# EAGLE design devboard (EAGLE 9.0.1)

## Sheet 1 of 2
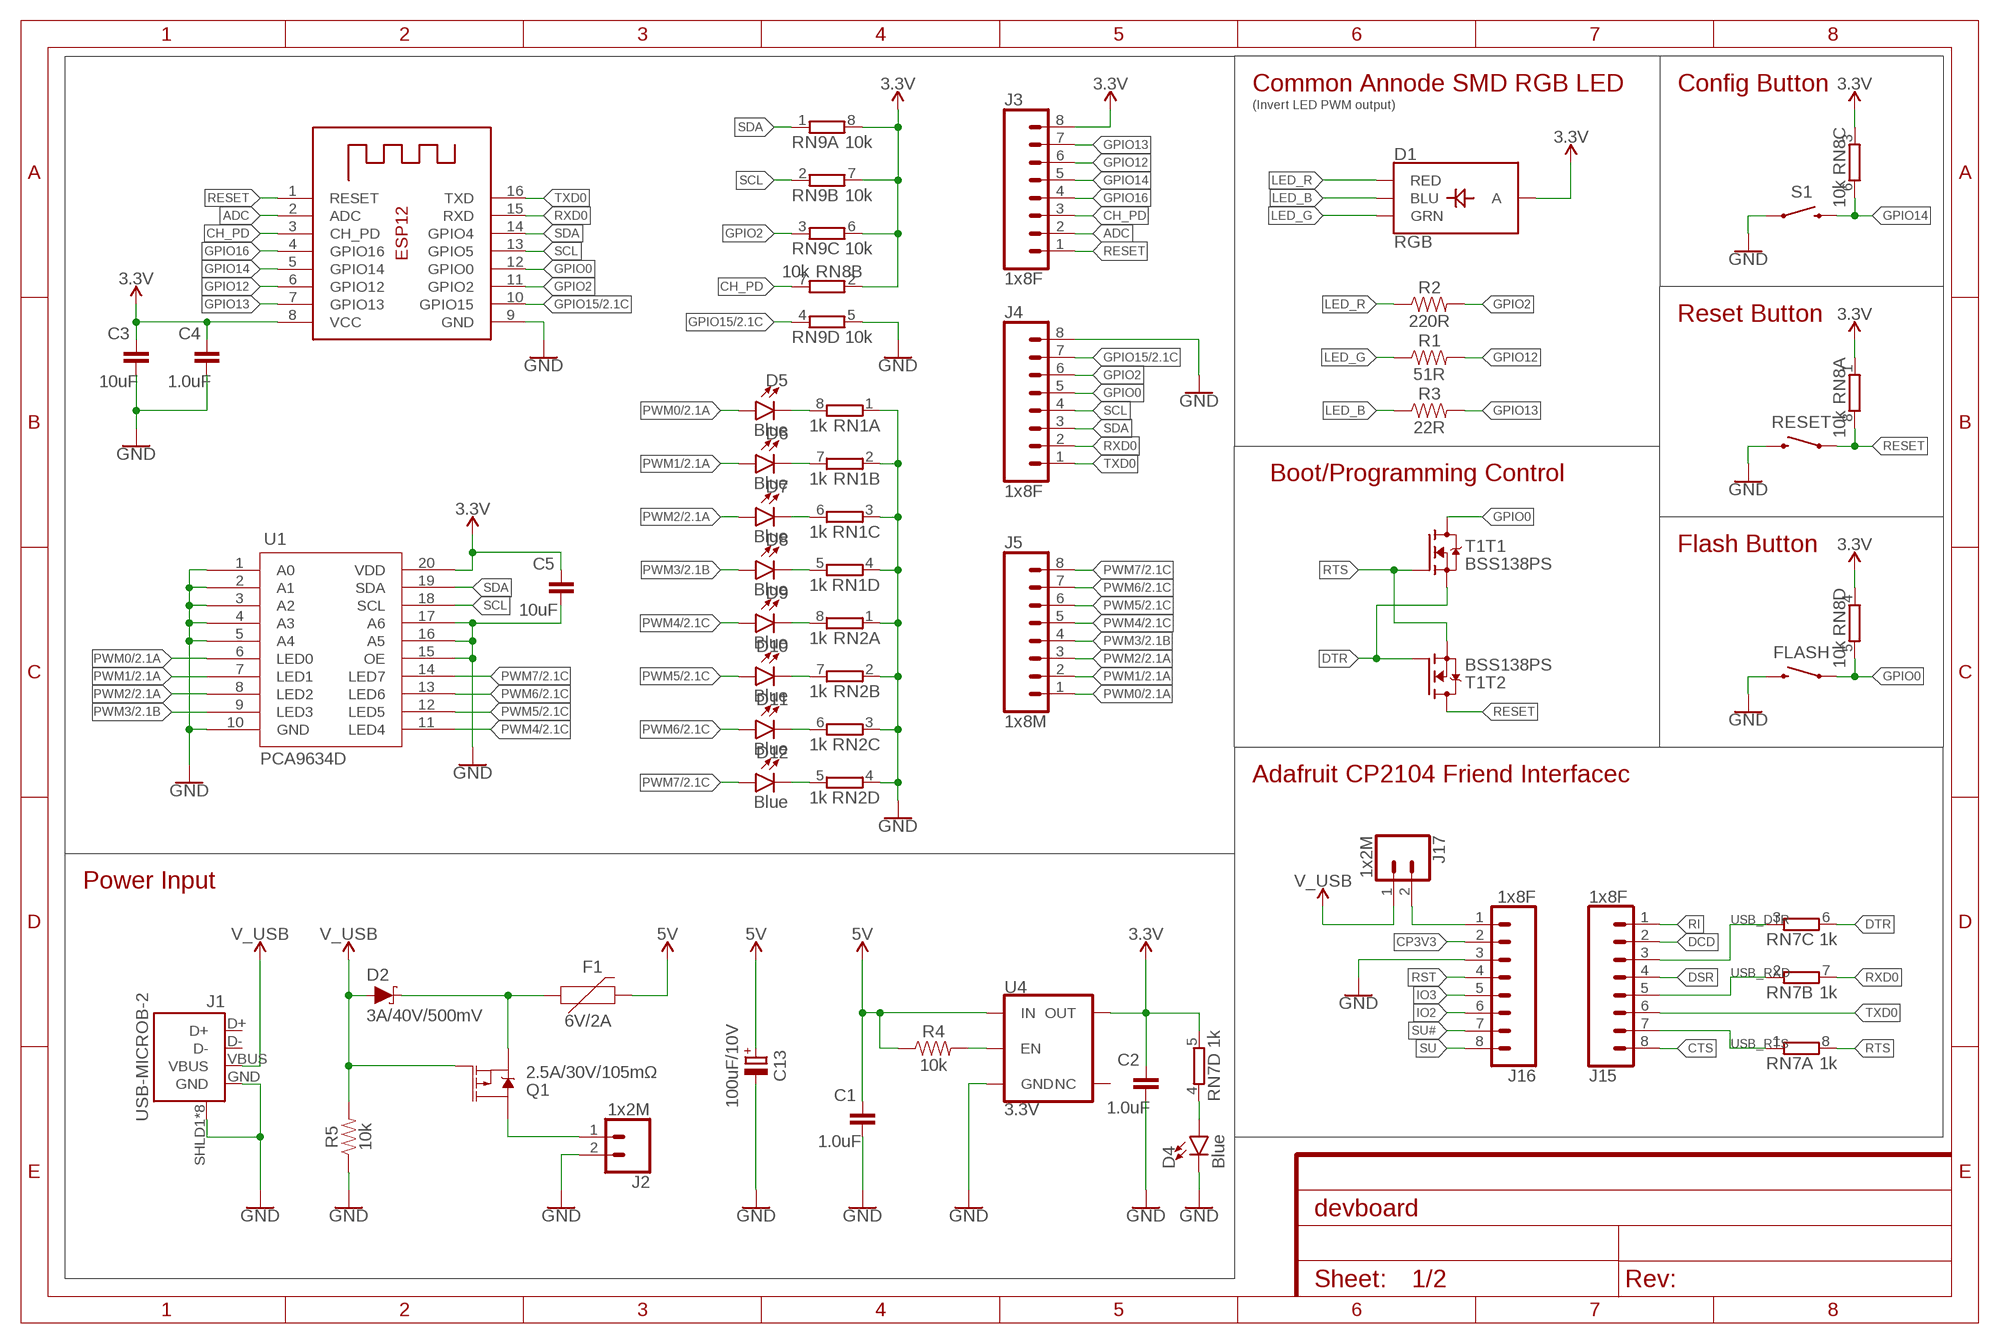
[diagram p0: schematic, sheet 1]
FRAME1 (FRAME-A4L): CNAME: VibHub ESP8266 Devboard; CREVISION: 0.1; DESIGNER: Kadah

### Parts
C1  1.0uF  CAPACITOR-1206  [C1206]
C2  1.0uF  CAPACITOR-1206  [C1206]
C3  10uF  CAPACITOR-1206  [C1206]
C4  1.0uF  CAPACITOR-1206  [C1206]
C5  10uF  CAPACITOR-1206  [C1206]
C13  100uF/10V  CAPACITOR_POLPANASONIC_D  [PANASONIC_D]
D1  RGB  LED-RGB-CAPLCC  [P-LCC-4-3]
D2  3A/40V/500mV  DIODE-SCHOTTKY-B340A  [SMA-DIODE]
D4  Blue  LED0805-NO_OUTLINE  [CHIPLED_0805_NOOUTLINE]
D5  Blue  LED0805-NO_OUTLINE  [CHIPLED_0805_NOOUTLINE]
D6  Blue  LED0805-NO_OUTLINE  [CHIPLED_0805_NOOUTLINE]
D7  Blue  LED0805-NO_OUTLINE  [CHIPLED_0805_NOOUTLINE]
D8  Blue  LED0805-NO_OUTLINE  [CHIPLED_0805_NOOUTLINE]
D9  Blue  LED0805-NO_OUTLINE  [CHIPLED_0805_NOOUTLINE]
D10  Blue  LED0805-NO_OUTLINE  [CHIPLED_0805_NOOUTLINE]
D11  Blue  LED0805-NO_OUTLINE  [CHIPLED_0805_NOOUTLINE]
D12  Blue  LED0805-NO_OUTLINE  [CHIPLED_0805_NOOUTLINE]
F1  6V/2A  PPTC_HALF-AMP  [1206]
FLASH  MOMENTARY-SWITCH-SPST-SMD-6.0X3.5MM  [TACTILE_SWITCH_SMD_6.0X3.5MM]
J1  USB-MICROB-2  [USB-MICROB-10118194]
J2  1x2M  CONN_02LOCK_LONGPADS  [1X02_LOCK_LONGPADS]
J3  1x8F  CONN_08FEMALE_LOCK  [1X08_FEMALE_LOCK]
J4  1x8F  CONN_08FEMALE_LOCK  [1X08_FEMALE_LOCK]
J5  1x8M  CONN_08LOCK  [1X08_LOCK]
J15  1x8F  CONN_08FEMALE_LOCK  [1X08_FEMALE_LOCK]
J16  1x8F  CONN_08FEMALE_LOCK  [1X08_FEMALE_LOCK]
J17  1x2M  CONN_02LOCK_LONGPADS  [1X02_LOCK_LONGPADS]
Q1  2.5A/30V/105mΩ  MOSFET_PCH-DMG2307L  [SOT23-3]
R1  51R  RESISTOR0805  [0805]
R2  220R  RESISTOR0805  [0805]
R3  22R  RESISTOR0805  [0805]
R4  10k  RESISTOR0805  [0805]
R5  10k  RESISTOR0805  [0805]
RESET  MOMENTARY-SWITCH-SPST-SMD-6.0X3.5MM  [TACTILE_SWITCH_SMD_6.0X3.5MM]
RN1  1k  4R-NEXBS8V  [EXBS8V]
RN2  1k  4R-NEXBS8V  [EXBS8V]
RN7  1k  4R-NEXBS8V  [EXBS8V]
RN8  10k  4R-NEXBS8V  [EXBS8V]
RN9  10k  4R-NEXBS8V  [EXBS8V]
S1  MOMENTARY-SWITCH-SPST-PTH-6.0MM  [TACTILE_SWITCH_PTH_6.0MM]
T1  BSS138PS  [SOT363]
U1  PCA9634D  PCA963420-SO  [SOIC127P1032X265-20]
U4  3.3V  V_REG_AP2112K-3.3V  [SOT23-5]
X1  ESP12  ESP-12  [ESP-12]

### Nets
3.3V: C2.1 C3.1 C4.1 C5.1 D1.4(A) J3.8 RN7.5 RN8.1 RN8.2 RN8.3 RN8.4 RN9.6 RN9.7 RN9.8 U1.20(VDD) U4.5(OUT) X1.8(VCC) ; also sheet 2
5V: C1.1 C13.+ F1.2 R4.1 U4.1(IN) ; also sheet 2
ADC: J3.2 X1.2(ADC)
CH_PD: J3.3 RN8.7 X1.3(CH_PD)
CP3V3: J16.2
CTS: J15.8
DCD: J15.2
DSR: J15.4
DTR: RN7.6 T1.1(T1:S) T1.5(T2:G)
GND: C1.2 C2.2 C3.2 C4.2 C5.2 C13.- D4.C FLASH.2 J1.GND J1.SHLD1(SHIELD) J1.SHLD2(SHIELD) J1.SHLD3(SHIELD) J1.SHLD4(SHIELD) J1.SHLD5(SHIELD) J1.SHLD6(SHIELD) J1.SHLD7(SHIELD) J1.SHLD8(SHIELD) J2.2 J4.8 J16.3 R5.1 RESET.2 RN1.1 RN1.2 RN1.3 RN1.4 RN2.1 RN2.2 RN2.3 RN2.4 RN9.5 S1.1 U1.1(A0) U1.2(A1) U1.3(A2) U1.4(A3) U1.5(A4) U1.10(GND) U1.15(OE) U1.16(A5) U1.17(A6) U4.2(GND) X1.9(GND) ; also sheet 2
GPIO0: FLASH.1 J4.5 RN8.5 T1.6(T1:D) X1.12(GPIO0)
GPIO2: J4.6 R2.2 RN9.3 X1.11(GPIO2)
GPIO12: J3.6 R1.2 X1.6(GPIO12)
GPIO13: J3.7 R3.2 X1.7(GPIO13)
GPIO14: J3.5 RN8.6 S1.3 X1.5(GPIO14)
GPIO15: J4.7 RN9.4 X1.10(GPIO15) ; also sheet 2
GPIO16: J3.4 X1.4(GPIO16)
IO2: J16.6
IO3: J16.5
LED_B: D1.3(BLU) R3.1
LED_G: D1.2(GRN) R1.1
LED_R: D1.1(RED) R2.1
N$1: R4.2 U4.3(EN)
N$2: D5.C RN1.8
N$3: D6.C RN1.7
N$4: J2.1 Q1.3(D)
N$5: D2.C F1.1 Q1.2(S)
N$6: D7.C RN1.6
N$7: D8.C RN1.5
N$8: D9.C RN2.8
N$9: D10.C RN2.7
N$10: D11.C RN2.6
N$11: D12.C RN2.5
N$31: J16.1 J17.2
PWM0: D5.A J5.1 U1.6(LED0) ; also sheet 2
PWM1: D6.A J5.2 U1.7(LED1) ; also sheet 2
PWM2: D7.A J5.3 U1.8(LED2) ; also sheet 2
PWM3: D8.A J5.4 U1.9(LED3) ; also sheet 2
PWM4: D9.A J5.5 U1.11(LED4) ; also sheet 2
PWM5: D10.A J5.6 U1.12(LED5) ; also sheet 2
PWM6: D11.A J5.7 U1.13(LED6) ; also sheet 2
PWM7: D12.A J5.8 U1.14(LED7) ; also sheet 2
PWR_LED: D4.A RN7.4
RESET: J3.1 RESET.1 RN8.8 T1.3(T2:D) X1.1(RESET)
RI: J15.1
RST: J16.4
RTS: RN7.8 T1.2(T1:G) T1.4(T2:S)
RXD0: J4.2 RN7.7 X1.15(RXD)
SCL: J4.4 RN9.2 U1.18(SCL) X1.13(GPIO5)
SDA: J4.3 RN9.1 U1.19(SDA) X1.14(GPIO4)
SU: J16.8
SU#: J16.7
TXD0: J4.1 J15.6 X1.16(TXD)
USB_DTR: J15.3 RN7.3
USB_RTS: J15.7 RN7.1
USB_RXD: J15.5 RN7.2
V_USB: D2.A J1.VBUS J17.1 Q1.1(G) R5.2
Unconnected: J1.D+ J1.D- U4.4(NC)

### Notes on the sheet
- Common Annode SMD RGB LED | Config Button
- (Invert LED PWM output)
- Reset Button
- Boot/Programming Control
- Flash Button
- Adafruit CP2104 Friend Interfacec
- Power Input

## Sheet 2 of 2
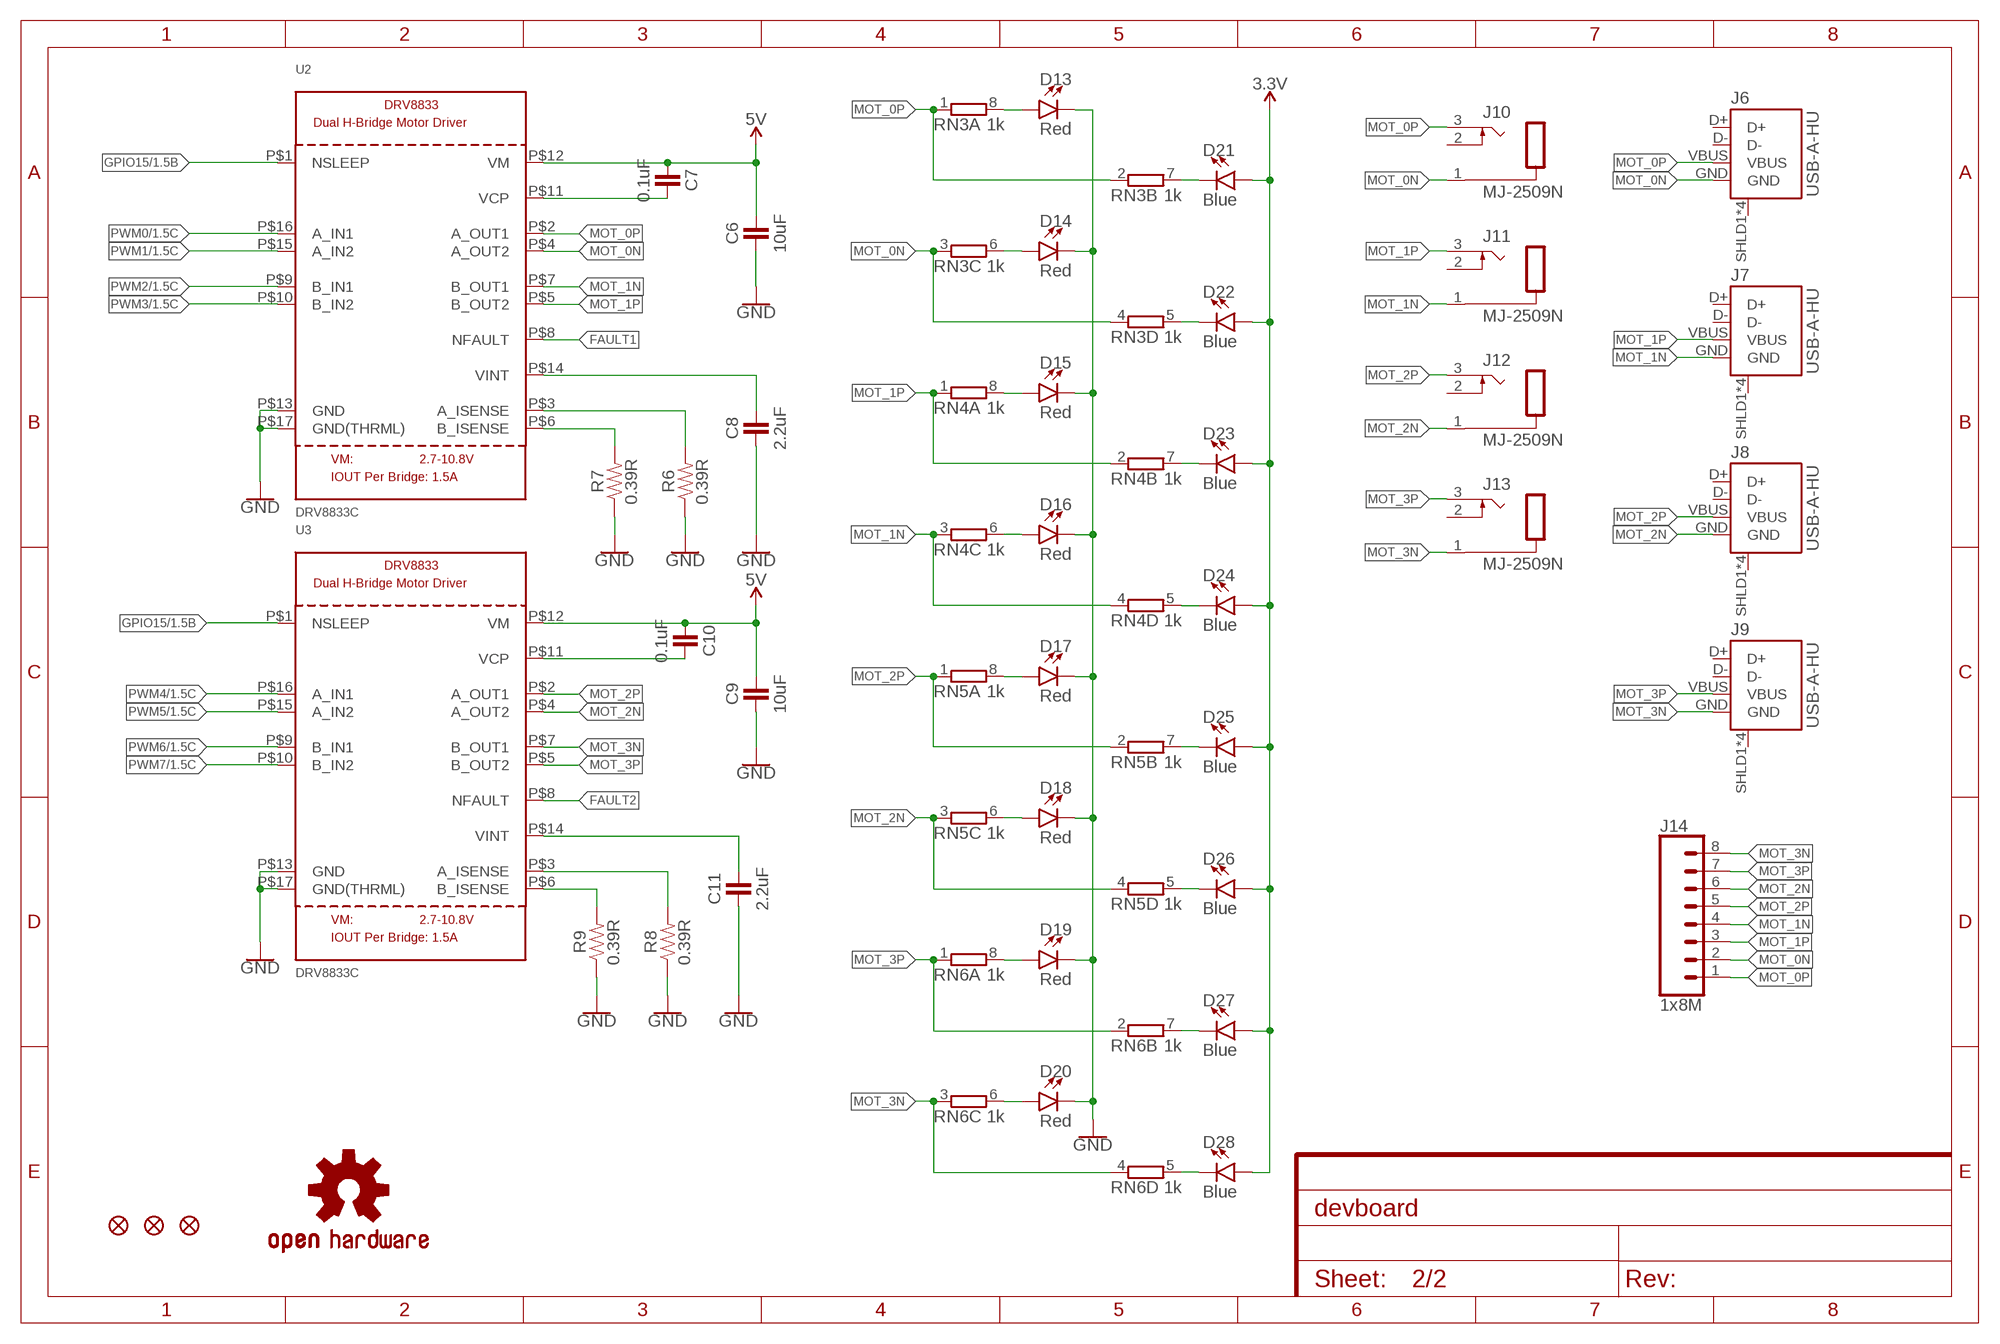
[diagram p1: schematic, sheet 2]

### Parts
C6  10uF  CAPACITOR-1206  [C1206]
C7  0.1uF  CAPACITOR-1206  [C1206]
C8  2.2uF  CAPACITOR-1206  [C1206]
C9  10uF  CAPACITOR-1206  [C1206]
C10  0.1uF  CAPACITOR-1206  [C1206]
C11  2.2uF  CAPACITOR-1206  [C1206]
D13  Red  LED0805-NO_OUTLINE  [CHIPLED_0805_NOOUTLINE]
D14  Red  LED0805-NO_OUTLINE  [CHIPLED_0805_NOOUTLINE]
D15  Red  LED0805-NO_OUTLINE  [CHIPLED_0805_NOOUTLINE]
D16  Red  LED0805-NO_OUTLINE  [CHIPLED_0805_NOOUTLINE]
D17  Red  LED0805-NO_OUTLINE  [CHIPLED_0805_NOOUTLINE]
D18  Red  LED0805-NO_OUTLINE  [CHIPLED_0805_NOOUTLINE]
D19  Red  LED0805-NO_OUTLINE  [CHIPLED_0805_NOOUTLINE]
D20  Red  LED0805-NO_OUTLINE  [CHIPLED_0805_NOOUTLINE]
D21  Blue  LED0805-NO_OUTLINE  [CHIPLED_0805_NOOUTLINE]
D22  Blue  LED0805-NO_OUTLINE  [CHIPLED_0805_NOOUTLINE]
D23  Blue  LED0805-NO_OUTLINE  [CHIPLED_0805_NOOUTLINE]
D24  Blue  LED0805-NO_OUTLINE  [CHIPLED_0805_NOOUTLINE]
D25  Blue  LED0805-NO_OUTLINE  [CHIPLED_0805_NOOUTLINE]
D26  Blue  LED0805-NO_OUTLINE  [CHIPLED_0805_NOOUTLINE]
D27  Blue  LED0805-NO_OUTLINE  [CHIPLED_0805_NOOUTLINE]
D28  Blue  LED0805-NO_OUTLINE  [CHIPLED_0805_NOOUTLINE]
FD1  FIDUCIAL1X2  [FIDUCIAL-1X2]
FD2  FIDUCIAL1X2  [FIDUCIAL-1X2]
FD3  FIDUCIAL1X2  [FIDUCIAL-1X2]
J6  USB-A-HU  [USB-A-HU]
J7  USB-A-HU  [USB-A-HU]
J8  USB-A-HU  [USB-A-HU]
J9  USB-A-HU  [USB-A-HU]
J10  MJ-2509N  [MJ-2509N]
J11  MJ-2509N  [MJ-2509N]
J12  MJ-2509N  [MJ-2509N]
J13  MJ-2509N  [MJ-2509N]
J14  1x8M  CONN_08LOCK  [1X08_LOCK]
LOGO1  OSHW-LOGOM  [OSHW-LOGO-M]
R6  0.39R  RESISTOR0805  [0805]
R7  0.39R  RESISTOR0805  [0805]
R8  0.39R  RESISTOR0805  [0805]
R9  0.39R  RESISTOR0805  [0805]
RN3  1k  4R-NEXBS8V  [EXBS8V]
RN4  1k  4R-NEXBS8V  [EXBS8V]
RN5  1k  4R-NEXBS8V  [EXBS8V]
RN6  1k  4R-NEXBS8V  [EXBS8V]
U2  DRV8833C  DRV8833  [HTSSOP16]
U3  DRV8833C  DRV8833  [HTSSOP16]

### Nets
3.3V: D21.A D22.A D23.A D24.A D25.A D26.A D27.A D28.A ; also sheet 1
5V: C6.2 C7.1 C9.2 C10.1 U2.P$12(VM) U3.P$12(VM) ; also sheet 1
A_ISENSE0: R6.2 U2.P$3(A_ISENSE)
A_ISENSE1: R8.2 U3.P$3(A_ISENSE)
B_ISENSE0: R7.2 U2.P$6(B_ISENSE)
B_ISENSE1: R9.2 U3.P$6(B_ISENSE)
FAULT1: U2.P$8(NFAULT)
FAULT2: U3.P$8(NFAULT)
GND: C6.1 C8.1 C9.1 C11.1 D13.C D14.C D15.C D16.C D17.C D18.C D19.C D20.C R6.1 R7.1 R8.1 R9.1 U2.P$13(GND) U2.P$17(GND(THRML)) U3.P$13(GND) U3.P$17(GND(THRML)) ; also sheet 1
GPIO15: U2.P$1(NSLEEP) U3.P$1(NSLEEP) ; also sheet 1
MOT_0N: J6.GND J10.1(S) J14.2 RN3.3 RN3.4 U2.P$4(A_OUT2)
MOT_0P: J6.VBUS J10.3(T) J14.1 RN3.1 RN3.2 U2.P$2(A_OUT1)
MOT_1N: J7.GND J11.1(S) J14.4 RN4.3 RN4.4 U2.P$7(B_OUT1)
MOT_1P: J7.VBUS J11.3(T) J14.3 RN4.1 RN4.2 U2.P$5(B_OUT2)
MOT_2N: J8.GND J12.1(S) J14.6 RN5.3 RN5.4 U3.P$4(A_OUT2)
MOT_2P: J8.VBUS J12.3(T) J14.5 RN5.1 RN5.2 U3.P$2(A_OUT1)
MOT_3N: J9.GND J13.1(S) J14.8 RN6.3 RN6.4 U3.P$7(B_OUT1)
MOT_3P: J9.VBUS J13.3(T) J14.7 RN6.1 RN6.2 U3.P$5(B_OUT2)
N$15: D21.C RN3.7
N$16: D13.A RN3.8
N$17: D14.A RN3.6
N$18: D15.A RN4.8
N$19: D16.A RN4.6
N$20: D17.A RN5.8
N$21: D18.A RN5.6
N$22: D19.A RN6.8
N$23: D20.A RN6.6
N$24: D22.C RN3.5
N$25: D23.C RN4.7
N$26: D24.C RN4.5
N$27: D28.C RN6.5
N$28: D27.C RN6.7
N$29: D26.C RN5.5
N$30: D25.C RN5.7
PWM0: U2.P$16(A_IN1) ; also sheet 1
PWM1: U2.P$15(A_IN2) ; also sheet 1
PWM2: U2.P$9(B_IN1) ; also sheet 1
PWM3: U2.P$10(B_IN2) ; also sheet 1
PWM4: U3.P$16(A_IN1) ; also sheet 1
PWM5: U3.P$15(A_IN2) ; also sheet 1
PWM6: U3.P$9(B_IN1) ; also sheet 1
PWM7: U3.P$10(B_IN2) ; also sheet 1
VCP0: C7.2 U2.P$11(VCP)
VCP1: C10.2 U3.P$11(VCP)
VINT0: C8.2 U2.P$14(VINT)
VINT1: C11.2 U3.P$14(VINT)
Unconnected: J6.D+ J6.D- J6.SHLD1(SHIELD) J6.SHLD2(SHIELD) J6.SHLD3(SHIELD) J6.SHLD4(SHIELD) J7.D+ J7.D- J7.SHLD1(SHIELD) J7.SHLD2(SHIELD) J7.SHLD3(SHIELD) J7.SHLD4(SHIELD) J8.D+ J8.D- J8.SHLD1(SHIELD) J8.SHLD2(SHIELD) J8.SHLD3(SHIELD) J8.SHLD4(SHIELD) J9.D+ J9.D- J9.SHLD1(SHIELD) J9.SHLD2(SHIELD) J9.SHLD3(SHIELD) J9.SHLD4(SHIELD) J10.2(TS) J11.2(TS) J12.2(TS) J13.2(TS)

## Library data of the parts
C1-C11 = vibhud:CAPACITOR: Capacitors ...2.2uF @ 6.3V -> 0402 ...4.7uF @ 6.3V -> 0603 ...10uF @ 16V -> 0805 ...22uF @ 25V -> 1206
C13 = vibhud:CAPACITOR_POL: Polarized Capacitors
D1 = vibhud:LED-RGB-CA: LED-RGB Diffused Common Anode Packages: LED RGB-THRU P-LCC-4-3 LED-TRICOLOR-SMD SparkFun Products: RGB Diffused Common Anode- Diffuse <[https://www.sparkfun.com/products/10821]> RGB Diffused Common Anode - Clear <[https://www.sparkfun.com/products/10820]> Qduino Mini <[https://www.sparkfun.com/products/13614]> Triple Output LED RGB - SMD <https://www.sparkfun.com/products/7844>; PROD_ID: DIO-12986
D2 = vibhud:DIODE-SCHOTTKY: Schottky diode A Schottky diode is a semiconductor diode which has a low forward voltage drop and a very fast switching action.; PROD_ID: DIO-09886
D4-D28 = vibhud:LED: LED (Generic) Standard schematic elements and footprints for 5mm, 3mm, 1206, and 0603 sized LEDs. Generic LEDs with no color specified.
F1 = vibhud:PPTC: Resettable Fuse PPTC Resettable Fuse. Really a sort of resistor with a polymeric positive temperature coefficient whose resistance increases dramatically with an increase in temperature. When heated by the power passing through the resistance rises causing the current to be limited, protecting the circuit. This is achieved by the transition of the polymer from a crystalline to an amorphous state where the conductive carbon separates breaking the conductive pathways found in the cool crystalline structure. When a PPTC cools back down it resumes conducting letting the circuit turn back on. SparkFun Products: SparkFun RedBoard - Programmed with Arduino <https://www.sparkfun.com/products/12757> Pro Micro - 5V/16MHz <https://www.sparkfun.com/products/12640> Arduino Pro 328 - 5V/16MHz <https://www.sparkfun.com/products/10915> MP3 Trigger <https://www.sparkfun.com/products/13720>; PROD_ID: RES-08585; VALUE: 6V/0.5A
FD1-FD3 = vibhud:FIDUCIAL: Fiducial Alignment Points Point-of-reference for pick-and-place machines and other optical instruments.
FLASH RESET = vibhud:MOMENTARY-SWITCH-SPST: Momentary Switch (Pushbutton) - SPST Normally-open (NO) SPST momentary switches (buttons, pushbuttons). Variants PTH-12MM - 12mm square, through-hole Momentary Pushbutton Switch - 12mm Square <https://www.sparkfun.com/products/9190> (COM-09190) PTH-6.0MM, PTH-6.0MM-KIT - 6.0mm square, through-hole Mini Pushbutton Switch <https://www.sparkfun.com/products/97> (COM-00097) KIT package intended for soldering kit's - only one side of pads' copper is exposed. PTH-RIGHT-ANGLE-KIT - Right-angle, through-hole Right Angle Tactile Button <https://www.sparkfun.com/products/10791> - Used on SparkFun BigTime Watch Kit <https://www.sparkfun.com/products/11734> SMD-12MM - 12mm square, surface-mount Tactile Button - SMD (12mm) <https://www.sparkfun.com/products/12993> (COM-12993) Used on SparkFun PicoBoard <https://www.sparkfun.com/products/11888> SMD-4.5MM - 4.5mm Square Trackball Switch Used on SparkFun Blackberry Trackballer Breakout <https://www.sparkfun.com/products/13169> SMD-4.6MMX2.8MM - 4.60mm x 2.80mm, surface mount Used on SparkFun SAMD21 Mini Breakout <https://www.sparkfun.com/products/13664> SMD-5.2MM, SMD-5.2-REDUNDANT - 5.2mm square, surface-mount Mini Pushbutton Switch - SMD <https://www.sparkfun.com/products/8720> (COM-08720) Used on Arduino Pro Mini <https://www.sparkfun.com/products/11114> REDUNDANT package connects both switch circuits together SMD-6.0X3.5MM - 6.0 x 3.5mm, surface mount Momentary Reset Switch SMD <https://www.sparkfun.com/products/8229> (COM-08229) SMD-6.2MM-TALL - 6.2mm square, surface mount Tactile Button - SMD (6mm) <https://www.sparkfun.com/products/12992> Used on SparkFun Digital Sandbox <https://www.sparkfun.com/products/12651> SMD-RIGHT-ANGLE - Right-angle, surface mount Used on SparkFun Block for Intel® Edison - Arduino <https://www.sparkfun.com/products/13036>; PROD_ID: SWCH-00815; SF_SKU: COM-08229
J1 = vibhud:USB: USB Connectors; DIGIKEY: 609-4618-6-ND
J2 J17 = vibhud:CONN_02: Multi connection point. Often used as Generic Header-pin footprint for 0.1 inch spaced/style header connections On any of the 0.1 inch spaced packages, you can populate with these: Break Away Headers - Straight <https://www.sparkfun.com/products/116> (PRT-00116) Break Away Male Headers - Right Angle <https://www.sparkfun.com/products/553> (PRT-00553) Female Headers <https://www.sparkfun.com/products/115> (PRT-00115) Break Away Headers - Machine Pin <https://www.sparkfun.com/products/117> (PRT-00117) Break Away Female Headers - Swiss Machine Pin <https://www.sparkfun.com/products/743> (PRT-00743) For SCREWTERMINALS and SPRING TERMINALS visit here: Screw Terimnals on SparkFun.com <https://www.sparkfun.com/search/results?term=Screw+Terminals> (5mm/3.5mm/2.54mm spacing) This device is also useful as a general connection point to wire up your design to another part of your project. Our various solder wires solder well into these plated through hole pads. Hook-Up Wire - Assortment (Stranded, 22 AWG) <https://www.sparkfun.com/products/11375> (PRT-11375) Hook-Up Wire - Assortment (Solid Core, 22 AWG) <https://www.sparkfun.com/products/11367> (PRT-11367) View the entire wire category on our website here <https://www.sparkfun.com/categories/141> Special notes: Molex polarized connector foot print use with: PRT-08233 with associated crimp pins and housings. 2.54_SCREWTERM for use with PRT-10571. 3.5mm Screw Terminal footprints for PRT-08084 5mm Screw Terminal footprints for use with PRT-08432
J3 J4 J15 J16 = vibhud:CONN_08: Multi connection point. Often used as Generic Header-pin footprint for 0.1 inch spaced/style header connections On any of the 0.1 inch spaced packages, you can populate with these: Break Away Headers - Straight <https://www.sparkfun.com/products/116> (PRT-00116) Break Away Male Headers - Right Angle <https://www.sparkfun.com/products/553> (PRT-00553) Female Headers <https://www.sparkfun.com/products/115> (PRT-00115) Break Away Headers - Machine Pin <https://www.sparkfun.com/products/117> (PRT-00117) Break Away Female Headers - Swiss Machine Pin <https://www.sparkfun.com/products/743> (PRT-00743) Arduino Stackable Header - 8 Pin <https://www.sparkfun.com/products/9279> (PRT-09279) For SCREWTERMINALS and SPRING TERMINALS visit here: Screw Terimnals on SparkFun.com <https://www.sparkfun.com/search/results?term=Screw+Terminals> (5mm/3.5mm/2.54mm spacing) This device is also useful as a general connection point to wire up your design to another part of your project. Our various solder wires solder well into these plated through hole pads. Hook-Up Wire - Assortment (Stranded, 22 AWG) <https://www.sparkfun.com/products/11375> (PRT-11375) Hook-Up Wire - Assortment (Solid Core, 22 AWG) <https://www.sparkfun.com/products/11367> (PRT-11367) View the entire wire category on our website here <https://www.sparkfun.com/categories/141> Special notes: Molex polarized connector foot print use with SKU : PRT-08231 with associated crimp pins and housings. 1MM SMD Version SKU: PRT-10208 NOTES ON THE VARIANTS LOCK and LOCK_LONGPADS... This footprint was designed to help hold the alignment of a through-hole component (i.e. 6-pin header) while soldering it into place. You may notice that each hole has been shifted either up or down by 0.005 of an inch from it's more standard position (which is a perfectly straight line). This slight alteration caused the pins (the squares in the middle) to touch the edges of the holes. Because they are alternating, it causes a "brace" to hold the component in place. 0.005 has proven to be the perfect amount of "off-center" position when using our standard breakaway headers. Although looks a little odd when you look at the bare footprint, once you have a header in there, the alteration is very hard to notice. Also,if you push a header all the way into place, it is covered up entirely on the bottom side.; PROD_ID: CONN-09233; SF_ID: PRT-09279
J5 J14 = vibhud:CONN_08: Multi connection point. Often used as Generic Header-pin footprint for 0.1 inch spaced/style header connections On any of the 0.1 inch spaced packages, you can populate with these: Break Away Headers - Straight <https://www.sparkfun.com/products/116> (PRT-00116) Break Away Male Headers - Right Angle <https://www.sparkfun.com/products/553> (PRT-00553) Female Headers <https://www.sparkfun.com/products/115> (PRT-00115) Break Away Headers - Machine Pin <https://www.sparkfun.com/products/117> (PRT-00117) Break Away Female Headers - Swiss Machine Pin <https://www.sparkfun.com/products/743> (PRT-00743) Arduino Stackable Header - 8 Pin <https://www.sparkfun.com/products/9279> (PRT-09279) For SCREWTERMINALS and SPRING TERMINALS visit here: Screw Terimnals on SparkFun.com <https://www.sparkfun.com/search/results?term=Screw+Terminals> (5mm/3.5mm/2.54mm spacing) This device is also useful as a general connection point to wire up your design to another part of your project. Our various solder wires solder well into these plated through hole pads. Hook-Up Wire - Assortment (Stranded, 22 AWG) <https://www.sparkfun.com/products/11375> (PRT-11375) Hook-Up Wire - Assortment (Solid Core, 22 AWG) <https://www.sparkfun.com/products/11367> (PRT-11367) View the entire wire category on our website here <https://www.sparkfun.com/categories/141> Special notes: Molex polarized connector foot print use with SKU : PRT-08231 with associated crimp pins and housings. 1MM SMD Version SKU: PRT-10208 NOTES ON THE VARIANTS LOCK and LOCK_LONGPADS... This footprint was designed to help hold the alignment of a through-hole component (i.e. 6-pin header) while soldering it into place. You may notice that each hole has been shifted either up or down by 0.005 of an inch from it's more standard position (which is a perfectly straight line). This slight alteration caused the pins (the squares in the middle) to touch the edges of the holes. Because they are alternating, it causes a "brace" to hold the component in place. 0.005 has proven to be the perfect amount of "off-center" position when using our standard breakaway headers. Although looks a little odd when you look at the bare footprint, once you have a header in there, the alteration is very hard to notice. Also,if you push a header all the way into place, it is covered up entirely on the bottom side.
J6-J9 = vibhud:USB: USB Connectors
J10-J13 = vibhud:MJ-2509N: Mono Audio Jack, 2.5 MM
LOGO1 = vibhud:OSHW-LOGO: Open-Source Hardware (OSHW) Logo This logo indicates the piece of hardware it is found on incorporates a OSHW license and/or adheres to the definition of open source hardware found here: http://freedomdefined.org/OSHW
Q1 = vibhud:MOSFET_PCH: P-channel MOSFETs Voltage controlled devices that allow control of high current outputs. SparkFun Products: SparkFun ESP32 Thing <https://www.sparkfun.com/products/13907> SparkFun ESP8266 Thing <https://www.sparkfun.com/products/13231>; PROD_ID: TRANS-11308
R1-R9 = vibhud:RESISTOR: Generic Resistor Package
RN1-RN9 = vibhud:4R-N: Array Chip Resistor Source: RS Component / Phycomp; OC_FARNELL: unknown; OC_NEWARK: unknown
S1 = vibhud:MOMENTARY-SWITCH-SPST: Momentary Switch (Pushbutton) - SPST Normally-open (NO) SPST momentary switches (buttons, pushbuttons). Variants PTH-12MM - 12mm square, through-hole Momentary Pushbutton Switch - 12mm Square <https://www.sparkfun.com/products/9190> (COM-09190) PTH-6.0MM, PTH-6.0MM-KIT - 6.0mm square, through-hole Mini Pushbutton Switch <https://www.sparkfun.com/products/97> (COM-00097) KIT package intended for soldering kit's - only one side of pads' copper is exposed. PTH-RIGHT-ANGLE-KIT - Right-angle, through-hole Right Angle Tactile Button <https://www.sparkfun.com/products/10791> - Used on SparkFun BigTime Watch Kit <https://www.sparkfun.com/products/11734> SMD-12MM - 12mm square, surface-mount Tactile Button - SMD (12mm) <https://www.sparkfun.com/products/12993> (COM-12993) Used on SparkFun PicoBoard <https://www.sparkfun.com/products/11888> SMD-4.5MM - 4.5mm Square Trackball Switch Used on SparkFun Blackberry Trackballer Breakout <https://www.sparkfun.com/products/13169> SMD-4.6MMX2.8MM - 4.60mm x 2.80mm, surface mount Used on SparkFun SAMD21 Mini Breakout <https://www.sparkfun.com/products/13664> SMD-5.2MM, SMD-5.2-REDUNDANT - 5.2mm square, surface-mount Mini Pushbutton Switch - SMD <https://www.sparkfun.com/products/8720> (COM-08720) Used on Arduino Pro Mini <https://www.sparkfun.com/products/11114> REDUNDANT package connects both switch circuits together SMD-6.0X3.5MM - 6.0 x 3.5mm, surface mount Momentary Reset Switch SMD <https://www.sparkfun.com/products/8229> (COM-08229) SMD-6.2MM-TALL - 6.2mm square, surface mount Tactile Button - SMD (6mm) <https://www.sparkfun.com/products/12992> Used on SparkFun Digital Sandbox <https://www.sparkfun.com/products/12651> SMD-RIGHT-ANGLE - Right-angle, surface mount Used on SparkFun Block for Intel® Edison - Arduino <https://www.sparkfun.com/products/13036>; PROD_ID: SWCH-08441; SF_SKU: COM-00097
T1 = vibhud:BSS138PS: Dual N-Channel MOSFET BSS138 (Vgs>=+/-20V, Vds>=40V, Id>=0.2A + Rds<=3Ohm @ Vgs=4.5V)
U1 = vibhud:PCA9634
U2 U3 = vibhud:DRV8833: DRV8833 Dual H-Bridge Motor Driver -- HTSSOP Package
U4 = vibhud:V_REG_AP2112: AP2112 - 600mA CMOS LDO Regulator w/ Enable The AP2112 is CMOS process low dropout linear regulator with enable function, the regulator delivers a guaranteed 600mA (min.) continuous load current. Features Output Voltage Accuracy: ±1.5% Output Current: 600mA (Min.) Foldback Short Current Protection: 50mA Enable Function to Turn ON/OFF VOUT Low Dropout Voltage (3.3V): 250mV (Typ.) @IOUT=600mA Excellent Load Regulation: 0.2%/A (Typ.) Excellent Line Regulation: 0.02%/V (Typ.) Low Quiescent Current: 55μA (Typ.) Low Standby Current: 0.01μA (Typ.) Low Output Noise: 50μVRMS PSRR: 100Hz -65dB, 1kHz -65dB OTSD Protection Stable with 1.0μF Flexible Cap: Ceramic, Tantalum and Aluminum Electrolytic Operation Temperature Range: -40°C to 85°C ESD: MM 400V, HBM 4000V; PROD_ID: VREG-12457
X1 = vibhud:ESP-12

## Board
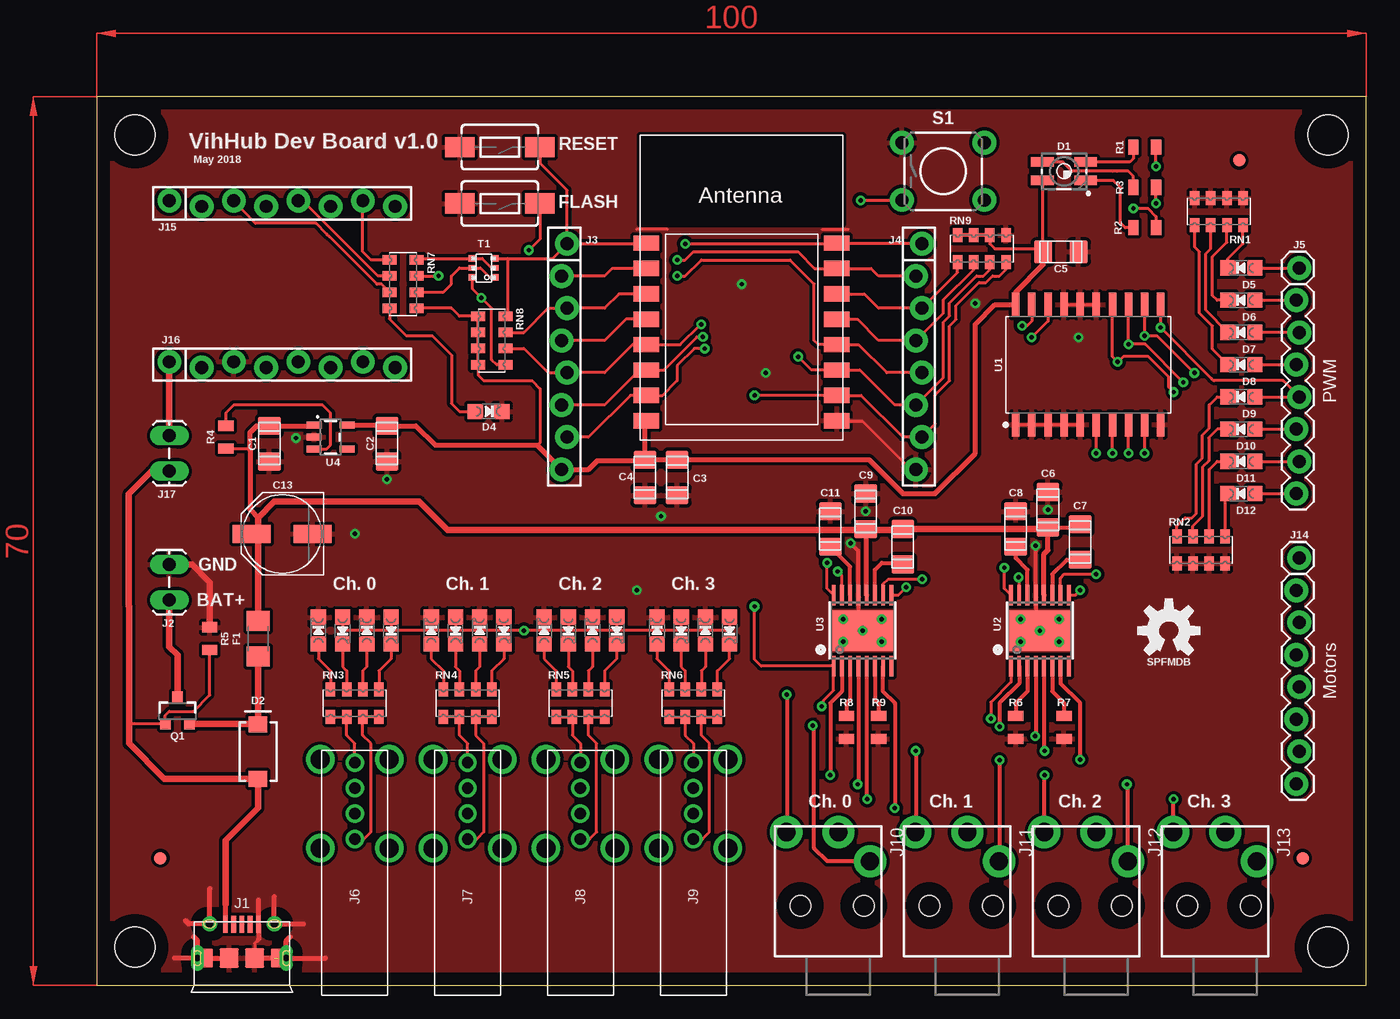
[diagram p2: board, top side]
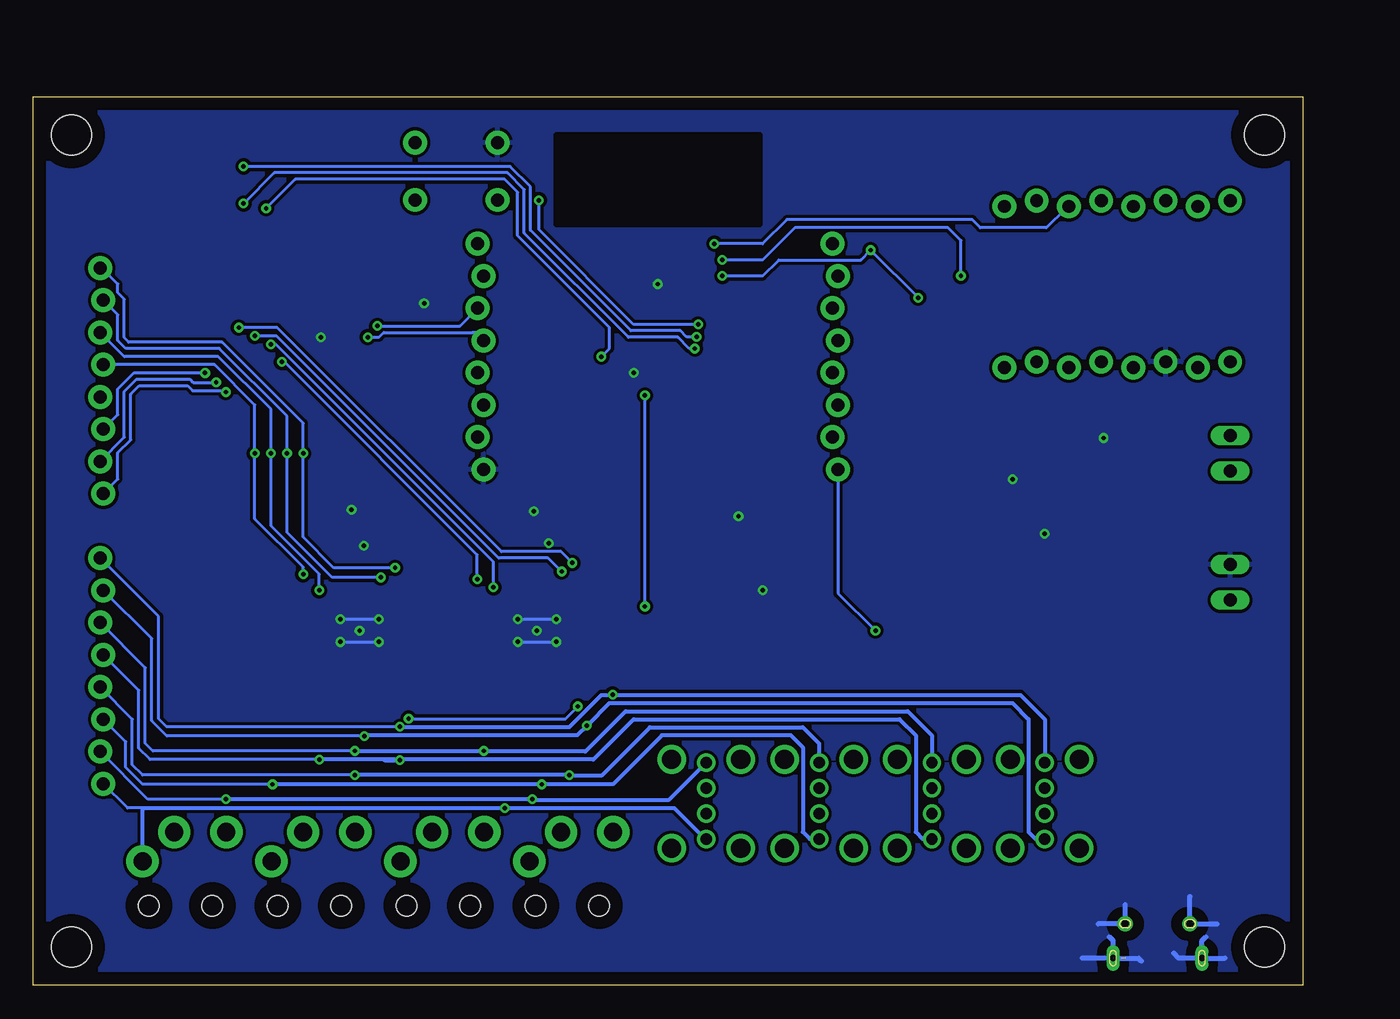
[diagram p3: board, bottom side, seen from below]

Size 100 x 70 mm. Coordinates in mm from the lower left corner, seen from the top.
Outline: 0,0 100,0 100,70 0,70 0,0
Copper layers (1*16): Top 0.035mm / dielectric 1.5mm / Bottom 0.035mm
Design rules "default *": minimum track width 6mil, minimum drill 0.35mm, track to track 10mil, track to pad 6mil, pad to pad 6mil, via to via 6mil, smd to smd 6mil, copper to edge 40mil, drill to drill 6mil, minimum pad ring 10mil, minimum via ring 8mil, stop-mask expansion 4mil, vias tented up to drill 0mil, thermal gap 10mil
Holes 3.17 mm at 97,3 3,3 3,67 97,67

### Footprints (pad centres in the part's own frame; a part is rotated, then mirrored left to right if it is on the bottom)
C1206 = smd 1.8 x 1.45: 1 0,1.4; 2 0,-1.4
PANASONIC_D = smd 3 x 1.4: + 2.4,0; - -2.4,0
P-LCC-4-3 = smd 1.8 x 0.75: 1 -1.7,0.725; 2 -1.7,-0.725; 3 1.7,-0.725; 4 1.7,0.725
SMA-DIODE = smd 1.27 x 1.47: A -2.15,0; C 2.15,0
CHIPLED_0805_NOOUTLINE = smd 1.2 x 1.2: A 0,-1.05; C 0,1.05
1206 = smd 1.6 x 1.8: 1 -1.4,0; 2 1.4,0
FIDUCIAL-1X2 = smd 1 x 1: 1 0,0
TACTILE_SWITCH_SMD_6.0X3.5MM = smd 2.3 x 1.6: 1 -3.15,0; 2 3.15,0
USB-MICROB-10118194 = smd 1.3 x 0.4: D+ -2.5,0; D- -2.5,-0.65; GND -2.5,1.3; ID -2.5,0.65; VBUS -2.5,-1.3 | drill 0.6 pad 1.2: SHLD1 -2.55,2.55; SHLD2 -2.55,-2.55 | drill 0.5 pad 0.8 long: SHLD3 0.15,3.5; SHLD4 0.15,-3.5 | smd 1.5 x 1.1: SHLD5 0.15,2.85; SHLD6 0.15,-2.85 | smd 1.5 x 1.5: SHLD7 0.15,1; SHLD8 0.15,-1
1X02_LOCK_LONGPADS = drill 1.016 long: 1 -0.127,0; 2 2.667,0
1X08_FEMALE_LOCK = drill 1.016 pad 1.88: 1 0,0.229; 2 2.54,-0.229; 3 5.08,0.229; 4 7.62,-0.229; 5 10.16,0.229; 6 12.7,-0.229; 7 15.24,0.229; 8 17.78,-0.229
1X08_LOCK = drill 1.016 pad 1.88: 1 0,0.127; 2 2.54,-0.127; 3 5.08,0.127; 4 7.62,-0.127; 5 10.16,0.127; 6 12.7,-0.127; 7 15.24,0.127; 8 17.78,-0.127
USB-A-HU = drill 0.9 pad 1.45: D+ -2.73,0; D- -4.73,0; GND -0.73,0; VBUS -6.73,0 | drill 1.5: SHLD1 -7,2.72; SHLD2 -7,-2.72; SHLD3 0,-2.72; SHLD4 0,2.72
MJ-2509N = drill 1.422 pad 2.54: 1 2.5,-2.3; 2 0,0; 3 -4.1,0 | hole 1.626: -3,-5.8; 2,-5.8
SOT23-3 = smd 0.8 x 0.9: 1 -0.95,-1; 2 0.95,-1; 3 0,1.1
0805 = smd 0.8 x 1.2: 1 -0.9,0; 2 0.9,0
EXBS8V = smd 0.75 x 1.1: 1 -1.905,-1.07; 2 -0.635,-1.07; 3 0.635,-1.07; 4 1.905,-1.07; 5 1.905,1.07; 6 0.635,1.07; 7 -0.635,1.07; 8 -1.905,1.07
TACTILE_SWITCH_PTH_6.0MM = drill 1.016 pad 1.88: 1 -3.251,2.261; 2 3.251,2.261; 3 -3.251,-2.261; 4 3.251,-2.261
SOT363 = smd 0.6 x 0.5: 1 -0.9,0.75; 3 -0.9,-0.75; 4 0.9,-0.75; 6 0.9,0.75 | smd 0.6 x 0.4: 2 -0.9,0; 5 0.9,0
SOIC127P1032X265-20 = smd 1.916 x 0.592: 1 -4.722,5.715; 2 -4.722,4.445; 3 -4.722,3.175; 4 -4.722,1.905; 5 -4.722,0.635; 6 -4.722,-0.635; 7 -4.722,-1.905; 8 -4.722,-3.175; 9 -4.722,-4.445; 10 -4.722,-5.715; 11 4.722,-5.715; 12 4.722,-4.445; 13 4.722,-3.175; 14 4.722,-1.905; 15 4.722,-0.635; 16 4.722,0.635; 17 4.722,1.905; 18 4.722,3.175; 19 4.722,4.445; 20 4.722,5.715
HTSSOP16 = smd 0.3 x 1.6: P$1 -2.275,-2.8; P$2 -1.625,-2.8; P$3 -0.975,-2.8; P$4 -0.325,-2.8; P$5 0.325,-2.8; P$6 0.975,-2.8; P$7 1.625,-2.8; P$8 2.275,-2.8; P$9 2.275,2.8; P$10 1.625,2.8; P$11 0.975,2.8; P$12 0.325,2.8; P$13 -0.325,2.8; P$14 -0.975,2.8; P$15 -1.625,2.8; P$16 -2.275,2.8 | smd 4.8 x 3.2: P$17 0,0
SOT23-5 = smd 0.55 x 1.2: 1 -0.95,-1.3; 2 0,-1.3; 3 0.95,-1.3; 4 0.95,1.3; 5 -0.95,1.3
ESP-12 = smd 2 x 1.2: 1 -7.5,4.5; 2 -7.5,2.5; 3 -7.5,0.5; 4 -7.5,-1.5; 5 -7.5,-3.5; 6 -7.5,-5.5; 7 -7.5,-7.5; 8 -7.5,-9.5; 9 7.5,-9.5; 10 7.5,-7.5; 11 7.5,-5.5; 12 7.5,-3.5; 13 7.5,-1.5; 14 7.5,0.5; 15 7.5,2.5; 16 7.5,4.5

### Placement (x,y rotation side)
C1  13.59,42.67 0 top
C2  22.86,42.67 0 top
C3  45.72,40.01 0 top
C4  43.18,40.01 0 top
C5  75.95,57.78 90 top
C6  74.93,37.47 0 top
C7  77.47,34.92 0 top
C8  72.39,35.94 0 top
C9  60.58,37.34 0 top
C10  63.5,34.54 0 top
C11  57.78,35.94 0 top
C13  14.61,35.56 180 top
D1  76.2,64.14 180 top
D2  12.7,18.41 90 top
D4  30.86,45.21 270 top
D5  90.17,56.52 90 top
D6  90.17,53.98 90 top
D7  90.17,51.44 90 top
D8  90.17,48.9 90 top
D9  90.17,46.35 90 top
D10  90.17,43.81 90 top
D11  90.17,41.27 90 top
D12  90.17,38.73 90 top
D13  17.46,27.94 0 top
D14  21.27,27.94 0 top
D15  26.35,27.94 0 top
D16  30.16,27.94 0 top
D17  35.24,27.94 0 top
D18  39.05,27.94 0 top
D19  44.13,27.94 0 top
D20  47.94,27.94 0 top
D21  19.37,27.94 180 top
D22  23.18,27.94 180 top
D23  28.26,27.94 180 top
D24  32.07,27.94 180 top
D25  37.15,27.94 180 top
D26  40.96,27.94 180 top
D27  46.04,27.94 180 top
D28  49.85,27.94 180 top
F1  8V/2.2A  [1206]  12.7,27.3 90 top
FD1  5,10 0 top
FD2  95,10 0 top
FD3  90,65 0 top
FLASH  31.75,61.59 180 top
J1  11.43,2.29 270 top
J2  5.71,30.48 90 top
J3  36.83,58.42 270 top
J4  64.77,58.42 270 top
J5  94.61,56.52 270 top
J6  20.32,10.79 270 top
J7  29.21,10.79 270 top
J8  38.1,10.79 270 top
J9  46.99,10.79 270 top
J10  58.42,12.06 0 top
J11  68.58,12.06 0 top
J12  78.74,12.06 0 top
J13  88.9,12.06 0 top
J14  94.61,33.66 270 top
J15  5.71,61.59 0 top
J16  5.71,48.9 0 top
J17  5.71,40.64 90 top
LOGO1  84.45,27.94 0 top
Q1  6.35,21.59 0 top
R1  82.55,66.04 0 top
R2  82.55,59.69 0 top
R3  82.55,62.87 0 top
R4  10.16,43.18 90 top
R5  8.89,27.3 270 top
R6  72.39,20.32 90 top
R7  76.2,20.32 90 top
R8  59.05,20.32 90 top
R9  61.59,20.32 90 top
RESET  31.75,66.04 180 top
RN1  88.39,60.96 180 top
RN2  87,34.29 0 top
RN3  20.32,22.23 0 top
RN4  29.21,22.23 0 top
RN5  38.1,22.23 0 top
RN6  46.99,22.23 0 top
RN7  24.13,55.24 270 top
RN8  31.11,50.8 270 top
RN9  69.72,58.04 0 top
S1  66.67,64.14 0 top
T1  30.48,56.52 180 top
U1  78.11,48.9 90 top
U2  74.3,27.94 0 top
U3  60.33,27.94 0 top
U4  18.41,43.18 270 top
X1  50.8,53.98 0 top

### Tracks (layer width: path | path; a pad name or v marks a point on that pad's centre or on a via)
3.3V  (via drill 0.35)
  Top 0.254: 74.3,63.2 D1.4 | RN8.4 RN8.3 RN8.2 RN8.1 28.57,52.7 27.94,53.34 RN7.5 | RN8.4 29.84,48.7 | D21.A 19.37,28.26 19.68,27.94 23.11,27.94 | 45.97,27.94 49.53,27.94 49.85,28.26 D28.A | 45.97,27.94 40.89,27.94 | 40.89,27.94 37.08,27.94 | 37.08,27.94 v33.66,27.94 32,27.94 | 32,27.94 28.32,27.94 | 28.32,27.94 23.11,27.94 | D27.A 46.04,28 45.97,27.94 | D26.A 40.96,28 40.89,27.94 | D25.A 37.15,28 37.08,27.94 | D24.A 32.07,28 32,27.94 | D23.A 28.26,28 28.32,27.94 | D22.A 23.18,28 23.11,27.94 | 30.05,42.6 30.1,42.55 | C5.1 74.49,58.04 | 74.49,63.4 D1.4 | RN9.6 70.36,58.42 70.74,58.04 74.29,58.04 C5.1 | C5.1 74.55,63.36 D1.4 | RN8.4 30.05,48.06 30.48,47.62 34.29,47.62 34.92,46.99 34.92,42.77 34.7,42.55
  Top 0.305: RN9.6 RN9.7 RN9.8 | 74.35,63.26 D1.4
  Top 0.406: 45.65,41.34 C3.1 | C3.1 60.83,41.41 63.5,38.73 66.04,38.73 69.22,41.91 69.22,52.07 70.76,53.62 U1.20 72.39,54.61 74.55,56.77 C5.1 | U4.5 22.8,44.13 C2.1 25.14,44.07 26.67,42.55 30.1,42.55 34.7,42.55 J3.8 38.73,40.64 39.43,41.34 43.11,41.34 C4.1 | C4.1 C3.1 | C4.1 43.18,44.35 X1.8
  Bottom 0.254: J3.8 36.6,30.89 v33.66,27.94
5V
  Top 0.254: R4.1 11.95,42.28 12.06,42.16
  Top 0.305: 77.28,36.06 C7.1 77.21,36.06 C6.2
  Top 0.406: U2.P$12 74.62,33.98 74.93,34.29 C6.2 | U3.P$12 60.65,35.87 C9.2 | 12.7,36.83 12.06,37.47 12.06,42.16 12.06,43.56 12.58,44.07 C1.1 17.06,44.07 U4.1
  Top 0.508: 60.66,35.88 60.65,35.87 | 60.65,35.87 27.63,35.87 25.4,38.1 13.97,38.1 12.7,36.83 12.7,36.05 C13.+ 12.7,35.06 F1.2 | 74.74,35.88 C6.2 74.81,35.94 C10.1 63.42,35.87 60.65,35.87
A_ISENSE0
  Top 0.305: U2.P$3 73.32,23.16 72.39,22.23 R6.2
A_ISENSE1
  Top 0.305: U3.P$3 59.35,22.52 59.05,22.23 R8.2
ADC
  Top 0.254: X1.2 40.6,56.48 40.01,55.88 J3.2
B_ISENSE0
  Top 0.305: U2.P$6 75.27,23.16 76.2,22.23 R7.2
B_ISENSE1
  Top 0.305: U3.P$6 61.3,22.52 61.59,22.23 R9.2
CH_PD
  Top 0.254: X1.3 41.14,54.48 40.01,53.34 J3.3 35.56,53.34 33.66,51.44 RN8.7
DTR
  Top 0.254: T1.1 30.98,55.77 30.23,56.52 T1.5 28.57,56.52 27.94,55.88 27.94,55.24 27.3,54.61 RN7.6
GND  (via drill 0.35)  (1 unrouted)
  Top 0.254: X1.9 58.33,44.45 60.33,44.45 64.14,40.64 | U2.P$17 74.93,27.94 v75.82,27.05 | v72.77,27.05 v72.77,28.83 v72.76,28.84 | U3.P$17 61.21,27.05 v61.85,27.05 | v58.8,27.05 v58.8,28.83 v58.79,28.84 | U1.1 U1.2 U1.3 U1.4 U1.5 | U1.17 U1.16 U1.15 | 13.97,2.14 J1.SHLD7 12.43,3.29 12.73,3.59 12.73,3.84 | 8.89,2.14 J1.SHLD8 | J1.GND 12.73,3.84 | 12.73,3.84 12.7,3.81 | 57.15,59.56 59.18,59.56 | 44.96,59.56 42.55,59.56
  Top 0.305: U3.P$17 60,28.27 U3.P$13 60,34.23 v59.41,34.82 | U2.P$17 73.97,28.27 U2.P$13 v73.97,34.62
  Top 0.406: 12.73,6.7 J1.GND 12.73,3.59 | J1.SHLD3 18.01,2.14 | 16.27,4.84 J1.SHLD1 13.97,6.99 | J1.SHLD4 6.12,2.14 | J1.SHLD4 8.89,2.14 | J1.SHLD3 13.97,2.14 | 8.89,7.62 J1.SHLD2 7.23,4.84 6.99,5.08 | J1.SHLD4 7.93,3.5 7.62,3.81 | J1.SHLD3 14.93,3.5 15.24,3.81 | J1.SHLD6 J1.SHLD8 | J1.SHLD3 J1.SHLD7
  Top 0.508: R5.1 8.89,31.75 7.49,33.15 J2.2
  Bottom 0.254: v75.82,27.05 v72.77,27.05 | v72.77,28.83 v75.82,28.83 | v61.85,27.05 v58.8,27.05 | v58.8,28.83 v61.85,28.83
  Bottom 0.406: J1.SHLD4 6.12,2.14 | 6.74,4.84 J1.SHLD2 8.88,6.97 8.89,6.99 | J1.SHLD3 17.38,2.14 | 16.12,4.84 J1.SHLD1 13.97,6.35 | J1.SHLD3 14.93,3.5 15.24,3.81 | J1.SHLD4 7.93,3.5 7.62,3.81 | J1.SHLD3 12.93,2.14 12.7,1.91 | J1.SHLD4 9.76,2.14 10.16,2.54
  other vias: 60.33,27.94 74.3,27.94 22.86,39.88 20.32,35.56 77.34,51.05 52.7,48.26 50.8,55.24 15.68,43.12 60.58,37.34 74.93,37.47 44.45,36.96 42.55,31.11 69.22,53.72
  pour Bottom (isolate 0.254, rank 6): -0.64,-0.64 -0.64,70.48 100.33,70.48 100.33,-0.64
  pour Top (isolate 0.254, rank 6): -1.27,-1.27 -1.27,71.12 100.97,71.12 100.97,-1.27
GPIO0  (via drill 0.35)
  Top 0.254: v45.72,55.88 46.35,55.88 47.62,57.15 54.61,57.15 56.52,55.24 56.52,50.8 56.84,50.48 X1.12 60.02,50.48 62.23,48.26 J4.5 | T1.6 29.58,54.88 v30.29,54.17 31.11,53.34 31.11,49.28 31.5,48.9 RN8.5 | v34.04,57.92 34.9,58.79 FLASH.1
  Bottom 0.254: v45.72,55.88 42.55,55.88 41.27,57.15 34.81,57.15 v34.04,57.92 v30.29,54.18 v30.29,54.17
GPIO2  (via drill 0.35)
  Top 0.254: RN9.3 70.36,56.39 69.85,55.88 69.3,55.88 67.18,53.77 67.18,52.72 66.67,52.22 66.67,47.85 J4.6 62.87,45.72 60.11,48.48 X1.11 56.3,48.48 v55.24,49.53 | v81.66,61.21 82.8,61.21 83.45,60.57 R2.2
  Bottom 0.254: v55.24,49.53 54.61,50.16 54.61,51.82 61.85,59.06 61.85,62.48 62.87,63.5 79.38,63.5 v81.66,61.21
GPIO12  (via drill 0.35)
  Top 0.254: J3.6 40.01,45.72 42.76,48.48 X1.6 44.66,48.48 47.26,51.07 v47.75,51.07 | v83.44,64.52 83.44,66.03 R1.2
  Bottom 0.254: v47.75,51.07 48.53,51.07 49.02,51.56 52.91,51.56 60.83,59.48 60.83,62.91 62.44,64.52 v83.44,64.52
GPIO13  (via drill 0.35)
  Top 0.254: J3.7 38.73,43.18 42.03,46.48 X1.7 44.57,46.48 45.72,47.62 45.72,48.81 47.07,50.16 v47.88,50.16 | v83.44,61.59 83.45,61.61 R3.2
  Bottom 0.254: v47.88,50.16 48.34,50.16 49.23,51.05 53.13,51.05 61.34,59.27 61.34,62.69 62.66,64.01 81.03,64.01 v83.44,61.59
GPIO14  (via drill 0.35)
  Top 0.254: RN8.6 33.66,50.16 35.56,48.26 J3.5 40.01,48.26 42.22,50.48 X1.5 45.95,50.48 47.54,52.07 v47.62,52.07 | v60.17,61.85 60.2,61.87 S1.3
  Bottom 0.254: v47.62,52.07 52.7,52.07 60.17,59.54 v60.17,61.85
GPIO15  (via drill 0.35)
  Top 0.254: U2.P$1 72.02,23.88 70.44,22.3 v70.44,21 | v57.1,21.97 57.25,22.12 57.25,22.45 58.05,23.24 U3.P$1 52.33,25.14 51.82,25.65 v51.82,29.84 | v51.82,46.48 X1.10 60.2,46.48 63.5,43.18 J4.7 66.04,44.22 66.04,46.5 67.18,47.64 67.18,51.94 67.69,52.45 67.69,53.55 69.51,55.37 70.06,55.37 70.57,55.88 71.12,55.88 71.63,56.39 RN9.4
  Bottom 0.254: v70.44,21 58.07,21 v57.1,21.97 | v51.82,29.84 v51.82,46.48
GPIO16
  Top 0.254: X1.4 41.68,52.48 40.01,50.8 J3.4
LED_B
  Top 0.254: D1.3 76.11,64.86 76.83,64.14 80.01,64.14 80.38,64.14 81.28,64.14 81.65,63.77 R3.1
LED_G
  Top 0.254: R1.1 81.65,65.14 81.37,64.86 D1.2
LED_R
  Top 0.254: 77.99,63.5 D1.1 80.1,63.41 80.64,62.87 80.64,60.07 81.03,59.69 R2.1
MOT_0N  (via drill 0.35)
  Top 0.254: RN3.4 RN3.3 20.95,19.68 21.59,19.05 21.59,12.06 21.05,11.53 J6.GND
  Top 0.305: U2.P$4 73.97,19.69 v73.91,19.64 | J10.1 57.55,9.77 56.52,10.79 56.52,20.32 v56.39,20.45
  Bottom 0.254: v73.91,19.64 89.49,19.64 90.68,20.83 90.68,27.3 J14.2
  Bottom 0.305: J6.GND 21.05,11.53 21.59,12.06 21.59,20.95 22.86,22.23 54.61,22.23 v56.39,20.45 57.15,19.68 73.87,19.68 v73.91,19.64
MOT_0P  (via drill 0.35)
  Top 0.254: RN3.1 RN3.2 19.68,19.68 20.32,19.05 J6.VBUS
  Top 0.305: U2.P$2 72.67,23.77 71.12,22.23 v71.12,20.37 | v54.36,22.91 54.36,12.1 J10.3
  Bottom 0.254: v71.12,20.37 89.5,20.37 90.13,21 90.13,29.04 J14.1
  Bottom 0.305: J6.VBUS 20.32,20.95 22.23,22.86 54.4,22.86 | v71.12,20.37 71.07,20.32 57.78,20.32 55.24,22.86 54.4,22.86 | 54.4,22.86 v54.36,22.91
MOT_1N  (via drill 0.35)
  Top 0.254: RN4.4 RN4.3 29.84,19.68 30.48,19.05 30.48,12.06 29.94,11.53 J7.GND
  Top 0.305: U2.P$7 75.92,23.77 77.47,22.23 v77.47,17.78 | v71.12,17.73 71.12,9.8 J11.1
  Bottom 0.254: J14.4 91.69,23.24 91.69,18.67 90.81,17.78 v77.47,17.78
  Bottom 0.305: J7.GND 29.94,11.53 30.48,12.06 30.48,19.68 31.75,20.95 52.7,20.95 55.88,17.78 72.39,17.78 | 72.39,17.78 v77.47,17.78 | 72.39,17.78 72.34,17.73 v71.12,17.73
MOT_1P  (via drill 0.35)
  Top 0.254: RN4.1 RN4.2 28.57,19.68 29.21,19.05 J7.VBUS
  Top 0.305: U2.P$5 74.62,18.52 v74.68,18.46 | v64.52,18.46 64.52,12.1 J11.3
  Bottom 0.254: v74.68,18.46 90.6,18.46 91.19,19.05 91.19,25.02 J14.3
  Bottom 0.305: J7.VBUS 29.21,19.68 31.11,21.59 53.34,21.59 56.52,18.41 64.47,18.41 | 64.47,18.41 74.63,18.41 v74.68,18.46 | 64.47,18.41 v64.52,18.46
MOT_2N  (via drill 0.35)
  Top 0.254: RN5.4 RN5.3 38.73,19.68 39.37,19.05 39.37,12.06 38.83,11.53 J8.GND
  Top 0.305: J12.1 81.24,15.74 v81.15,15.83 | U3.P$4 60,15.88 v59.94,15.83
  Bottom 0.254: v81.15,15.83 91.39,15.83 92.71,17.14 92.71,19.18 J14.6
  Bottom 0.305: v81.15,15.83 v59.94,15.83 54.34,15.83 50.48,19.68 40.32,19.68 39.37,18.73 39.37,12.06 38.83,11.53 J8.GND
MOT_2P  (via drill 0.35)
  Top 0.254: RN5.1 RN5.2 37.47,19.68 38.1,19.05 J8.VBUS
  Top 0.305: J12.3 74.64,16.52 v74.68,16.56 | U3.P$2 58.7,23.14 57.78,22.23 v57.78,16.56
  Bottom 0.254: v74.68,16.56 91.41,16.56 92.2,17.36 92.2,20.95 J14.5
  Bottom 0.305: v74.68,16.56 v57.78,16.56 57.74,16.51 55.24,16.51 51.44,20.32 39.37,20.32 38.1,19.05 J8.VBUS
MOT_3N  (via drill 0.35)
  Top 0.254: RN6.4 RN6.3 47.62,19.68 48.26,19.05 48.26,12.06 47.72,11.53 J9.GND
  Top 0.305: U3.P$7 61.95,23.14 62.87,22.23 v62.87,13.97
  Bottom 0.254: 91.4,13.97 92.58,13.97 J14.8
  Bottom 0.305: J13.1 91.4,13.97 v62.87,13.97 49.53,13.97 47.09,11.53 J9.GND
MOT_3P  (via drill 0.35)
  Top 0.254: RN6.1 RN6.2 46.35,19.68 46.99,19.05 J9.VBUS
  Top 0.305: J13.3 84.8,14.62 v84.84,14.65 | U3.P$5 60.65,14.71 v60.71,14.65
  Bottom 0.254: v84.84,14.65 90.98,14.65 J14.7
  Bottom 0.305: v84.84,14.65 v60.71,14.65 60.66,14.61 49.91,14.61 J9.VBUS
N$1
  Top 0.254: U4.3 18.1,42.23 18.41,42.55 18.41,45.09 17.78,45.72 10.79,45.72 10.16,45.09 R4.2
N$2
  Top 0.254: D5.C 89.12,57.24 90.3,58.42 RN1.8
N$3
  Top 0.254: D6.C 88.27,53.98 87.88,54.36 87.88,57.4 89.03,58.55 RN1.7
N$4
  Top 0.508: Q1.3 6.35,26.04 5.71,26.67 J2.1
N$5
  Top 0.508: F1.1 D2.C 12.68,20.59 Q1.2
N$6
  Top 0.254: D7.C 87.38,53.18 87.38,57.66 87.76,58.04 RN1.6
N$7
  Top 0.254: D8.C 87.88,50.13 87.88,51.95 86.87,52.97 86.87,57.78 86.49,58.17 RN1.5
N$8
  Top 0.254: RN2.8 85.09,36.2 85.72,36.83 86.28,36.83 86.61,37.17 86.61,41.06 87.08,41.53 87.08,43.35 87.63,43.9 87.63,45.72 88.27,46.35 D9.C
N$9
  Top 0.254: RN2.7 86.36,36.2 87.12,36.96 87.12,40.85 87.59,41.32 87.59,43.14 88.27,43.81 D10.C
N$10
  Top 0.254: RN2.6 87.63,40.64 88.27,41.27 D11.C
N$11
  Top 0.254: RN2.5 88.9,38.52 D12.C
N$15
  Top 0.254: RN3.7 19.68,24.77 19.37,25.08 D21.C
N$16
  Top 0.254: RN3.8 18.41,24.77 17.46,25.72 D13.A
N$17
  Top 0.254: RN3.6 20.95,24.77 21.27,25.08 D14.A
N$18
  Top 0.254: RN4.8 27.3,24.77 26.35,25.72 D15.A
N$19
  Top 0.254: RN4.6 29.84,24.77 30.16,25.08 D16.A
N$20
  Top 0.254: RN5.8 36.2,24.77 35.24,25.72 D17.A
N$21
  Top 0.254: RN5.6 38.73,24.77 39.05,25.08 D18.A
N$22
  Top 0.254: RN6.8 45.09,24.77 44.13,25.72 D19.A
N$23
  Top 0.254: RN6.6 47.62,24.77 47.94,25.08 D20.A
N$24
  Top 0.254: RN3.5 22.23,24.77 23.18,25.72 D22.C
N$25
  Top 0.254: RN4.7 28.57,24.77 28.26,25.08 D23.C
N$26
  Top 0.254: RN4.5 31.11,24.77 32.07,25.72 D24.C
N$27
  Top 0.254: RN6.5 48.9,24.77 49.85,25.72 D28.C
N$28
  Top 0.254: RN6.7 46.35,24.77 46.04,25.08 D27.C
N$29
  Top 0.254: RN5.5 40.01,24.77 40.96,25.72 D26.C
N$30
  Top 0.254: RN5.7 37.47,24.77 37.15,25.08 D25.C
N$31
  Top 0.508: J17.2 J16.1
PWM0  (via drill 0.35)
  Top 0.254: D5.A J5.1 | U2.P$16 71.5,31.26 v71.5,32.89 | v78.74,41.91 U1.6
  Bottom 0.254: J5.1 94.61,56.52 93.34,55.24 93.34,54.56 92.84,54.05 92.84,51.01 92.5,50.67 85.14,50.67 78.74,44.28 v78.74,41.91 78.74,35.31 76.33,32.89 v71.5,32.89
PWM1  (via drill 0.35)
  Top 0.254: D6.A J5.2 | U2.P$15 72.67,32.1 v72.64,32.13 | v80.01,41.91 U1.7
  Bottom 0.254: v72.64,32.13 76.45,32.13 80.01,35.69 v80.01,41.91 80.01,44.83 85.35,50.16 92.71,50.16 93.34,50.8 93.34,52.83 J5.2
PWM2  (via drill 0.35)
  Top 0.254: J5.3 D7.A | U2.P$9 77.09,30.74 v77.47,31.11 | v81.28,41.91 U1.8
  Bottom 0.254: v77.47,31.11 77.47,32.38 81.28,36.2 v81.28,41.91 81.28,45.38 85.43,49.53 92.84,49.53 J5.3
PWM3  (via drill 0.35)
  Top 0.254: D8.A J5.4 | U2.P$10 75.92,32.1 76.2,32.38 v78.74,32.38 | v82.55,41.91 U1.9
  Bottom 0.254: J5.4 85.72,48.9 82.55,45.72 v82.55,41.91 82.55,36.75 78.74,32.94 v78.74,32.38
PWM4  (via drill 0.35)
  Top 0.254: D9.A J5.5 93.47,47.62 88.01,47.62 87.82,47.82 v83.82,51.82 U1.11 | U3.P$16 57.53,31.26 v57.53,33.27
  Bottom 0.254: v57.53,33.27 58.42,34.16 63.12,34.16 80.78,51.82 v83.82,51.82
PWM5  (via drill 0.35)
  Top 0.254: D10.A J5.6 | U3.P$15 58.7,32.28 v58.38,32.6 | U1.12 v82.55,51.16 83.55,51.16 v86.47,48.24
  Bottom 0.254: v58.38,32.6 59.44,33.66 63.33,33.66 80.84,51.16 v82.55,51.16 | J5.6 93.34,44.96 93.34,46.99 92.08,48.26 86.49,48.26 v86.47,48.24
PWM6  (via drill 0.35)
  Top 0.254: D11.A J5.7 | U1.13 v81.28,50.5 82.59,50.5 v85.6,47.5 | U3.P$9 63.15,30.74 v63.75,31.35
  Bottom 0.254: v81.28,50.5 80.9,50.5 63.75,33.36 v63.75,31.35 | J5.7 92.84,43.18 92.84,46.78 91.86,47.75 87.65,47.75 87.4,47.5 v85.6,47.5
PWM7  (via drill 0.35)
  Top 0.254: D12.A J5.8 | U1.14 80.01,49.53 v80.43,49.11 80.86,49.53 82.85,49.53 84.45,47.92 84.45,47.12 v84.84,46.74 | U3.P$10 61.95,31.6 62.36,32 v65.02,32
  Bottom 0.254: v80.43,49.11 80.22,49.11 65.02,33.91 v65.02,32 | J5.8 93.34,39.88 93.34,41.95 92.33,42.97 92.33,46.57 91.65,47.24 87.86,47.24 87.46,46.84 84.94,46.84 v84.84,46.74
PWR_LED
  Top 0.254: RN7.4 23.06,52.51 24.38,51.18 26.42,51.18 27.94,49.66 27.94,45.85 28.57,45.21 D4.A
RESET
  Top 0.254: T1.3 32.38,57.27 | RN8.8 32.38,52.91 32.38,57.27 | RESET.1 34.92,66.02 34.92,64.77 37.06,62.64 J3.1 | J3.1 43.24,58.42 X1.1 | 32.38,57.27 35.9,57.27 J3.1
RTS
  Top 0.254: T1.2 31.11,56.52 30.36,57.27 T1.4 25.32,57.27 RN7.8
RXD0  (via drill 0.35)
  Top 0.254: v45.72,57.15 46.35,57.15 46.99,57.78 55.24,57.78 56.55,56.48 X1.15 61,56.48 61.59,55.88 J4.2 | RN7.7 v26.92,55.88
  Bottom 0.254: v45.72,57.15 42.55,57.15 40.01,59.69 27.94,59.69 26.92,58.67 v26.92,55.88
SCL  (via drill 0.35)
  Top 0.254: X1.13 59.92,52.48 61.59,50.8 J4.4 66.67,52.93 66.67,53.98 69.09,56.39 RN9.2 | U1.18 74.93,52.32 v73.66,51.05
  Bottom 0.254: v73.66,51.05 72.77,51.05 72.39,51.44 65.41,51.44 65.18,51.44 J4.4
SDA  (via drill 0.35)
  Top 0.254: X1.14 60.46,54.48 61.59,53.34 J4.3 67.82,56.16 RN9.1 | v72.9,51.94 73.28,51.94 73.66,52.32 U1.19
  Bottom 0.254: v72.9,51.94 66.4,51.94 J4.3
TXD0  (via drill 0.35)
  Top 0.254: 58.24,58.42 X1.16 58.35,58.42 | v46.35,58.42 58.35,58.42 | J4.1 58.35,58.42
  Bottom 0.254: v46.35,58.42 42.55,58.42 40.64,60.33 34.92,60.33 26.04,60.33 25.4,59.69 20.19,59.69 19.63,60.25 J15.6
USB_DTR
  Top 0.254: RN7.3 22.44,55.23 22.08,55.23 18.33,58.97 18.12,59.18 17.27,60.03 12.49,60.03 J15.3
USB_RTS
  Top 0.254: RN7.1 21.59,57.15 20.95,57.78 J15.7
USB_RXD
  Top 0.254: RN7.2 22.14,55.88 16.3,61.72 J15.5
V_USB
  Top 0.254: R5.2 8.89,22.86 7.62,21.59 5.71,21.59 5.4,21.27 Q1.1 2.54,20.59 2.54,20.57
  Top 0.406: J1.VBUS 10.13,6.38
  Top 0.508: 10.13,6.38 10.13,11.4 12.7,13.97 D2.A 5.33,16.27 2.54,19.05 2.54,20.57 2.54,29.84 2.52,29.87 2.52,38.71 4.27,40.46 J17.1
VCP0
  Top 0.305: U2.P$11 75.27,32.38 76.41,33.52 C7.2
VCP1
  Top 0.305: U3.P$11 61.3,32.73 61.85,33.27 63.37,33.27 C10.2
VINT0
  Top 0.305: U2.P$14 73.32,32.73 72.39,33.66 C8.2
VINT1
  Top 0.305: U3.P$14 59.35,32.98 C11.2
(copper drawn outside any net)
  shapes: Top area x2

### Text on the board
tPlace: VihHub Dev Board v1.0 | May 2018 | PWM | GND | Ch. 0 | Ch. 1 | Ch. 2 | Ch. 3 | BAT+ | SPFMDB | Motors | Ch. 0 | Ch. 1 | Ch. 2 | Ch. 3